# Altium schematic sheet Sheet2_nRF52840_module.SchDoc: nRF52840 module
size A4; DrawnBy: D.N.Nhuan; Revision: NT-1.1; SheetNumber: 2; SheetTotal: 5
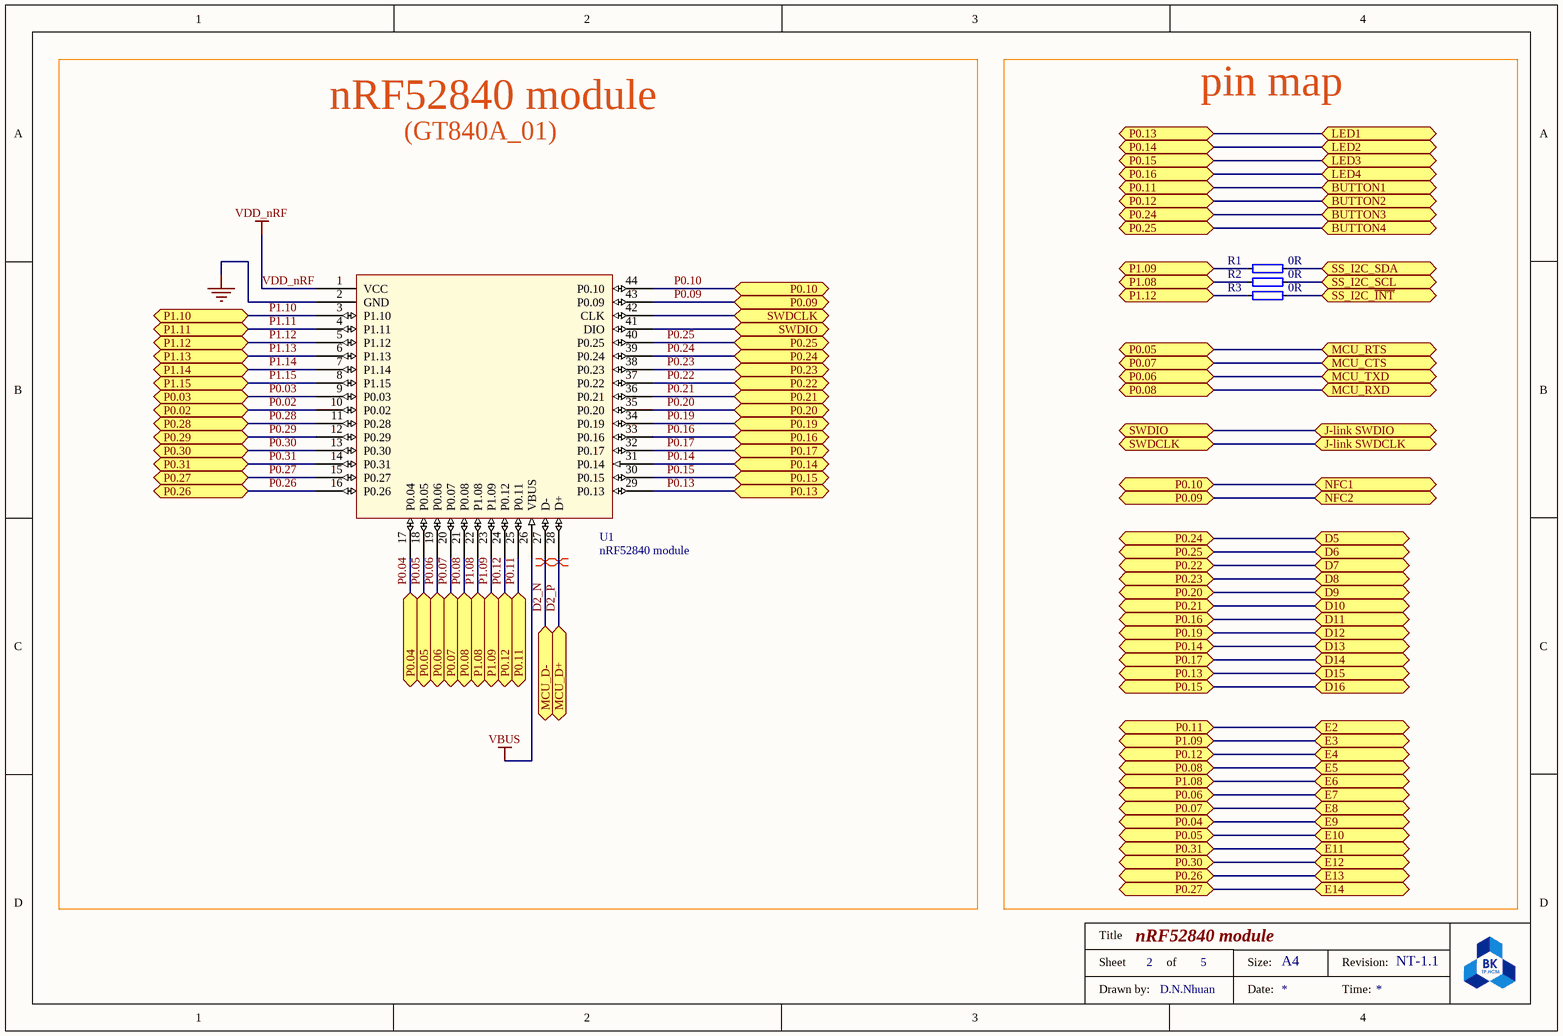
[diagram p0: Sheet2_nRF52840_module.SchDoc]

## Parts
R1  0R  [0402 imperial]
R2  0R  [0402 imperial]
R3  0R  [0402 imperial]
U1  nRF52840 module  [nRF52840_GT840A01]

## Blocks framed on the sheet
nRF52840 module: U1
pin map: R1-R3

## Ports
BUTTON1 (bidir), BUTTON2 (bidir), BUTTON3 (bidir), BUTTON4 (bidir), D5, D6, D7, D8, D9, D10, D11, D12, D13, D14, D15, D16, E2, E3, E4, E5, E6, E7, E8, E9, E10, E11, E12, E13, E14, J-link SWDCLK, J-link SWDIO, LED1 (bidir), LED2 (bidir), LED3 (bidir), LED4 (bidir), MCU_CTS, MCU_D+, MCU_D-, MCU_RTS, MCU_RXD, MCU_TXD, NFC1, NFC2, P0.02, P0.03, P0.04, P0.05, P0.06, P0.07, P0.08, P0.09, P0.10, P0.11, P0.12, P0.13, P0.14, P0.15, P0.16, P0.17, P0.19, P0.20, P0.21, P0.22, P0.23, P0.24, P0.25, P0.26, P0.27, P0.28, P0.29, P0.30, P0.31, P1.08, P1.09, P1.10, P1.11, P1.12, P1.13, P1.14, P1.15, SS_I2C_SCL, SS_I2C_SDA, SS_I2C_~{INT}, SWDCLK, SWDCLK (bidir), SWDIO, SWDIO (bidir)

## Nets
GND: U1.2(GND)
VBUS: U1.26(VBUS)
VDD_nRF: U1.1(VCC)
D2_N: U1.27(D-) ; port MCU_D-
D2_P: U1.28(D+) ; port MCU_D+
J-link SWDCLK: U1.42(CLK) ; port J-link SWDCLK, port SWDCLK
J-link SWDIO: U1.41(DIO) ; port SWDIO, port J-link SWDIO
P0.02: U1.10(P0.02) ; port P0.02
P0.03: U1.9(P0.03) ; port P0.03
P0.04: U1.17(P0.04) ; port E9, port P0.04
P0.05: U1.18(P0.05) ; port MCU_RTS, port P0.05, port E10
P0.06: U1.19(P0.06) ; port MCU_TXD, port P0.06, port E7
P0.07: U1.20(P0.07) ; port MCU_CTS, port P0.07, port E8
P0.08: U1.21(P0.08) ; port MCU_RXD, port P0.08, port E5
P0.09: U1.43(P0.09) ; port P0.09, port NFC2
P0.10: U1.44(P0.10) ; port P0.10, port NFC1
P0.11: U1.25(P0.11) ; port BUTTON1, port P0.11, port E2
P0.12: U1.24(P0.12) ; port BUTTON2, port P0.12, port E4
P0.13: U1.29(P0.13) ; port LED1, port P0.13, port D15
P0.14: U1.31(P0.14) ; port LED2, port P0.14, port D13
P0.15: U1.30(P0.15) ; port LED3, port P0.15, port D16
P0.16: U1.33(P0.16) ; port LED4, port P0.16, port D11
P0.17: U1.32(P0.17) ; port P0.17, port D14
P0.19: U1.34(P0.19) ; port P0.19, port D12
P0.20: U1.35(P0.20) ; port P0.20, port D9
P0.21: U1.36(P0.21) ; port P0.21, port D10
P0.22: U1.37(P0.22) ; port P0.22, port D7
P0.23: U1.38(P0.23) ; port P0.23, port D8
P0.24: U1.39(P0.24) ; port BUTTON3, port P0.24, port D5
P0.25: U1.40(P0.25) ; port BUTTON4, port P0.25, port D6
P0.26: U1.16(P0.26) ; port P0.26, port E13
P0.27: U1.15(P0.27) ; port P0.27, port E14
P0.28: U1.11(P0.28) ; port P0.28
P0.29: U1.12(P0.29) ; port P0.29
P0.30: U1.13(P0.30) ; port P0.30, port E12
P0.31: U1.14(P0.31) ; port P0.31, port E11
P1.08: R2.1 U1.22(P1.08) ; port E6, port P1.08
P1.09: R1.1 U1.23(P1.09) ; port E3, port P1.09
P1.10: U1.3(P1.10) ; port P1.10
P1.11: U1.4(P1.11) ; port P1.11
P1.12: R3.1 U1.5(P1.12) ; port P1.12
P1.13: U1.6(P1.13) ; port P1.13
P1.14: U1.7(P1.14) ; port P1.14
P1.15: U1.8(P1.15) ; port P1.15
SS_I2C_~{INT}: R3.2 ; port SS_I2C_~{INT}
SS_I2C_SCL: R2.2 ; port SS_I2C_SCL
SS_I2C_SDA: R1.2 ; port SS_I2C_SDA

## Layout directives
differential pair: D2_N, D2_P

## Notes on the sheet
- (GT840A_01)
- Title
- Sheet
- of
- Size:
- A4
- Revision:
- Drawn by:
- Date:
- Time:

## Library data of the parts
R1-R3 = Resistor: General Schematic; Tolerance: ±5%; Value: 0R; Supplier: *; Link of Supplier: *; Footprint: 0402
U1 = nRF52840_GT840A01: nRF52840 module GT840A_01